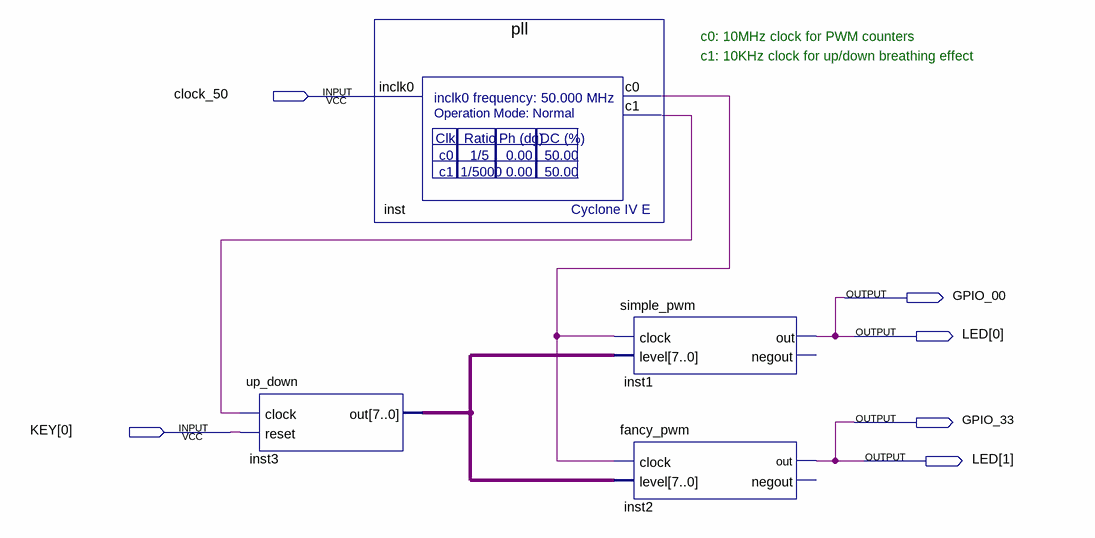
[diagram p0: schematic sheet]
// Quartus schematic pwm.bdf as structural Verilog: 4 symbols, 6 pins
module pwm (
  input  clock_50,
  input  [0:0] KEY,
  output GPIO_00,
  output [1:0] LED,
  output GPIO_33
);

  wire inst_c0, inst_c1;
  wire [7:0] inst3_out;

  up_down inst3 (.clock(inst_c1), .reset(KEY[0]), .out(inst3_out));
  pll inst (.inclk0(clock_50), .c0(inst_c0), .c1(inst_c1));
  simple_pwm inst1 (.clock(inst_c0), .level(inst3_out), .out(GPIO_00));  // open: negout
  fancy_pwm inst2 (.clock(inst_c0), .level(inst3_out), .out(GPIO_33));  // open: negout

  assign LED = {GPIO_33, GPIO_00};

  // Notes on the sheet:
  //   c0: 10MHz clock for PWM counters
  //   c1: 10KHz clock for up/down breathing effect
endmodule
